# EAGLE design fonte (EAGLE 9.6.2)
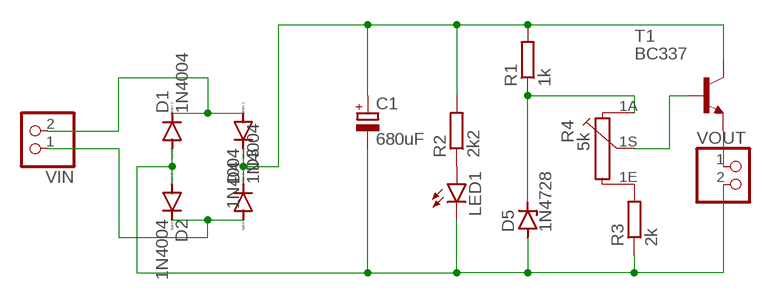
[diagram p0: schematic, sheet 1]

## Parts
C1  680uF  CPOL-EUE5-10.5  [E5-10,5]
D1  1N4004  [DO41-10]
D2  1N4004  [DO41-10]
D3  1N4004  [DO41-10]
D4  1N4004  [DO41-10]
D5  1N4728  [DO41Z10]
LED1  LED5MM  [LED5MM]
R1  1k  R-EU_0207/10  [0207/10]
R2  2k2  R-EU_0207/10  [0207/10]
R3  2k  R-EU_0207/10  [0207/10]
R4  5k  PC16S  [PC16S]
T1  BC337  [TO92]
VIN  PINHD-1X2  [1X02]
VOUT  PINHD-1X2  [1X02]

## Nets
N$1: C1.- D1.A D2.A D5.A LED1.K(C) R3.1 VOUT.2
N$2: C1.+ D3.C D4.C R1.2 R2.2 T1.3(C)
N$3: LED1.A R2.1
N$4: D5.C R1.1 R4.1A
N$5: D1.C D3.A VIN.2
N$6: D2.C D4.A VIN.1
N$7: T1.1(E) VOUT.1
N$8: R3.2 R4.1E
N$9: R4.1S T1.2(B)

## Library data of the parts
C1 = rcl:CPOL-EU: POLARIZED CAPACITOR, European symbol; SPICEPREFIX: C
D1-D4 = diode:1N4004: DIODE general purpose rectifier, 1 A
D5 = diode:1N4728: Z DIODE 3.3 V, 1W, 5 percent
LED1 = led:LED: LED OSRAM: - CHIPLED LG R971, LG N971, LY N971, LG Q971, LY Q971, LO R971, LY R971 LH N974, LH R974 LS Q976, LO Q976, LY Q976 LO Q996 - Hyper CHIPLED LW Q18S LB Q993, LB Q99A, LB R99A - SideLED LS A670, LO A670, LY A670, LG A670, LP A670 LB A673, LV A673, LT A673, LW A673 LH A674 LY A675 LS A676, LA A676, LO A676, LY A676, LW A676 LS A679, LY A679, LG A679 - Hyper Micro SIDELED® LS Y876, LA Y876, LO Y876, LY Y876 LT Y87S - SmartLED LW L88C, LW L88S LB L89C, LB L89S, LG L890 LS L89K, LO L89K, LY L89K LS L896, LA L896, LO L896, LY L896 - TOPLED LS T670, LO T670, LY T670, LG T670, LP T670 LSG T670, LSP T670, LSY T670, LOP T670, LYG T670 LG T671, LOG T671, LSG T671 LB T673, LV T673, LT T673, LW T673 LH T674 LS T676, LA T676, LO T676, LY T676, LB T676, LH T676, LSB T676, LW T676 LB T67C, LV T67C, LT T67C, LS T67K, LO T67K, LY T67K, LW E67C LS E67B, LA E67B, LO E67B, LY E67B, LB E67C, LV E67C, LT E67C LW T67C LS T679, LY T679, LG T679 LS T770, LO T770, LY T770, LG T770, LP T770 LB T773, LV T773, LT T773, LW T773 LH T774 LS E675, LA E675, LY E675, LS T675 LS T776, LA T776, LO T776, LY T776, LB T776 LHGB T686 LT T68C, LB T68C - Hyper Mini TOPLED® LB M676 - Mini TOPLED Santana® LG M470 LS M47K, LO M47K, LY M47K Source: http://www.osram.convergy.de LUXEON: - LUMILED® LXK2-PW12-R00, LXK2-PW12-S00, LXK2-PW14-U00, LXK2-PW14-V00 LXK2-PM12-R00, LXK2-PM12-S00, LXK2-PM14-U00 LXK2-PE12-Q00, LXK2-PE12-R00, LXK2-PE12-S00, LXK2-PE14-T00, LXK2-PE14-U00 LXK2-PB12-K00, LXK2-PB12-L00, LXK2-PB12-M00, LXK2-PB14-N00, LXK2-PB14-P00, LXK2-PB14-Q00 LXK2-PR12-L00, LXK2-PR12-M00, LXK2-PR14-Q00, LXK2-PR14-R00 LXK2-PD12-Q00, LXK2-PD12-R00, LXK2-PD12-S00 LXK2-PH12-R00, LXK2-PH12-S00 LXK2-PL12-P00, LXK2-PL12-Q00, LXK2-PL12-R00 Source: www.luxeon.com KINGBRIGHT: KA-3528ASYC Source: www.kingbright.com
R1-R3 = rcl:R-EU_: RESISTOR, European symbol; SPICEPREFIX: R
R4 = piher:PC16S: POTENTIOMETER single carbon potentiometer, 16 mm, S3ROH; OC_FARNELL: 4452940; OC_NEWARK: unknown
T1 = transistor:BC337: NPN TRANSISTOR
VIN VOUT = pinhead:PINHD-1X2: PIN HEADER

## Board
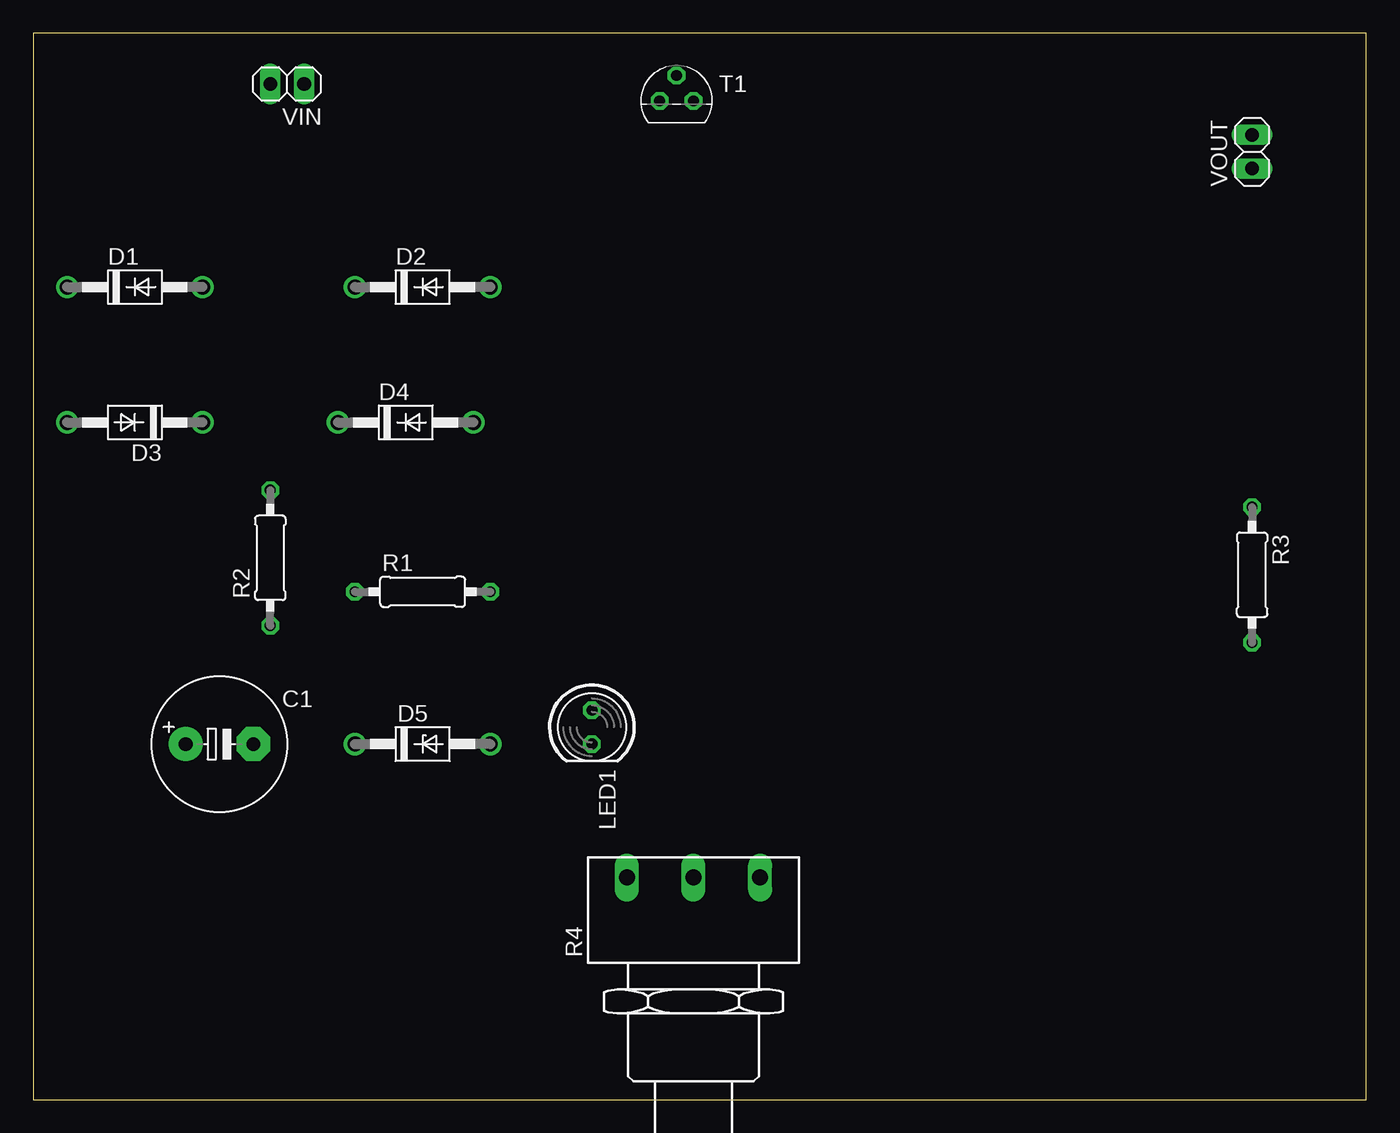
[diagram p1: board, top side]
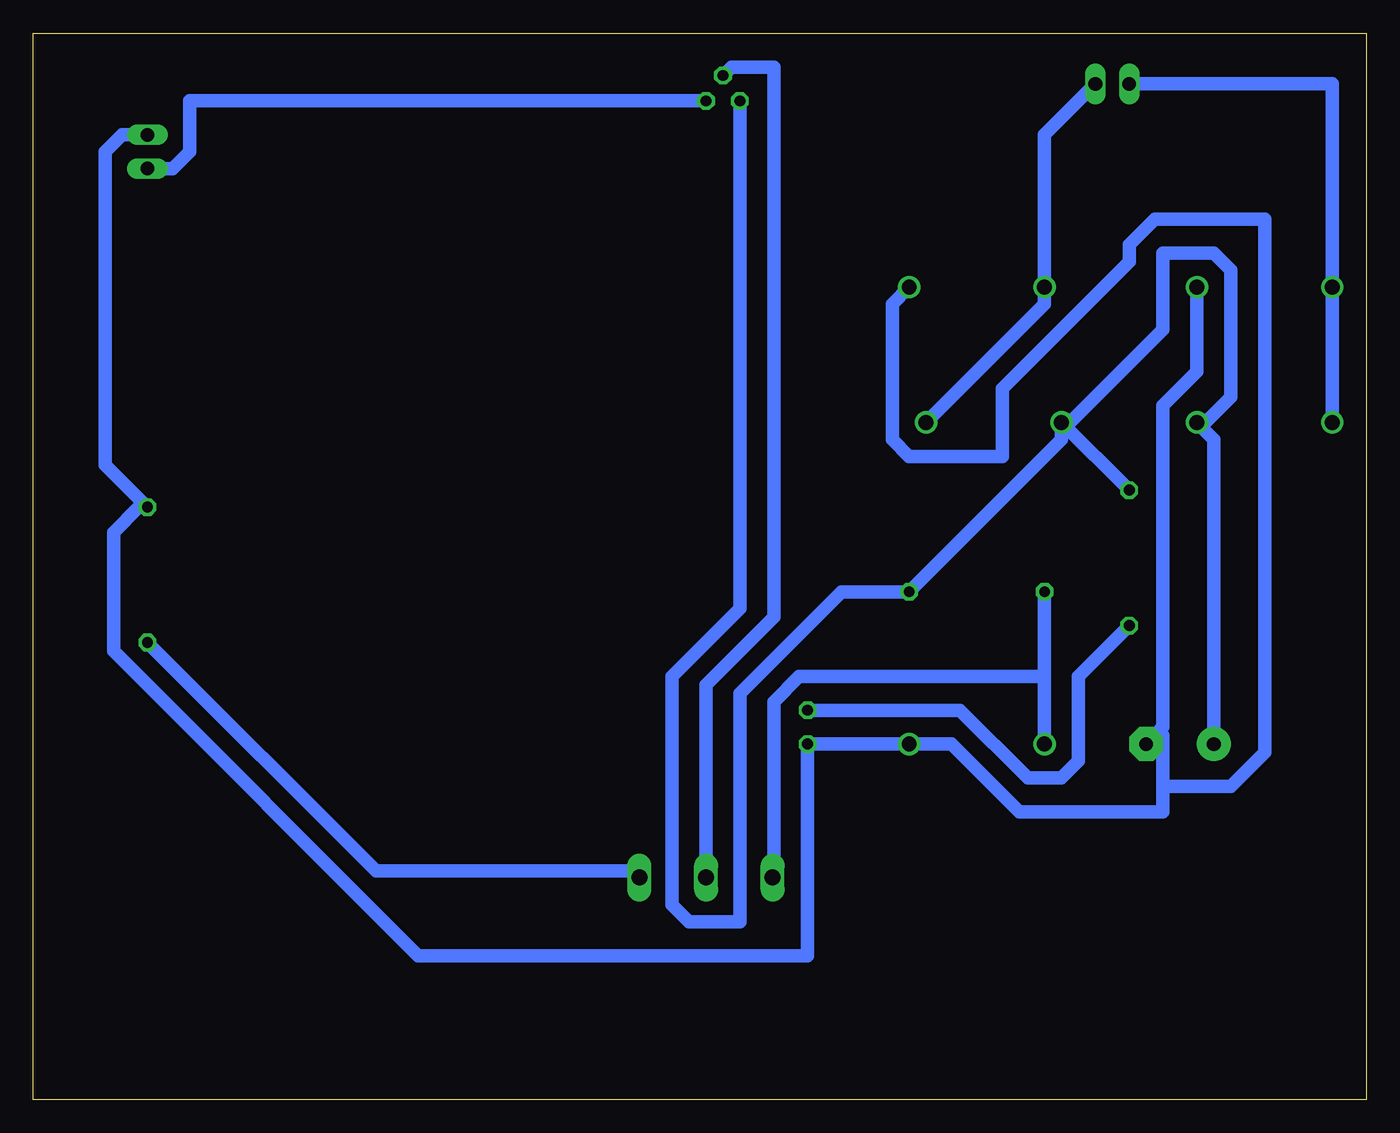
[diagram p2: board, bottom side, seen from below]

Size 100 x 80 mm. Coordinates in mm from the lower left corner, seen from the top.
Outline: 0,0 100,0 100,80 0,80 0,0
Copper layers (1*16): Top 0.035mm / dielectric 1.5mm / Bottom 0.035mm
Design rules "default *": minimum track width 40mil, minimum drill 0.35mm, track to track 40mil, track to pad 40mil, pad to pad 40mil, via to via 40mil, smd to smd 6mil, copper to edge 40mil, drill to drill 6mil, minimum pad ring 10mil, minimum via ring 8mil, stop-mask expansion 4mil, vias tented up to drill 0mil, thermal gap 10mil

### Footprints (pad centres in the part's own frame; a part is rotated, then mirrored left to right if it is on the bottom)
E5-10,5 = drill 1.016 pad 2.54: + -2.54,0 | drill 1.016 pad 2.54 octagon: - 2.54,0
DO41-10 = drill 1.118: A 5.08,0; C -5.08,0
DO41Z10 = drill 1.118: A 5.08,0; C -5.08,0
LED5MM = drill 0.813 octagon: A -1.27,0; K 1.27,0
0207/10 = drill 0.813 octagon: 1 -5.08,0; 2 5.08,0
PC16S = drill 1.2 long: 1A -5,6.5; 1E 5,6.5; 1S 0,6.5
TO92 = drill 0.813 octagon: 1 1.27,0; 2 0,1.905; 3 -1.27,0
1X02 = drill 1.016 long: 1 -1.27,0; 2 1.27,0

### Placement (x,y rotation side)
C1  13.97,26.67 0 top
D1  7.62,60.96 0 top
D2  29.21,60.96 0 top
D3  7.62,50.8 180 top
D4  27.94,50.8 0 top
D5  29.21,26.67 0 top
LED1  41.91,27.94 270 top
R1  29.21,38.1 0 top
R2  17.78,40.64 90 top
R3  91.44,39.37 270 top
R4  49.53,10.16 0 top
T1  48.26,74.93 0 top
VIN  19.05,76.2 180 top
VOUT  91.44,71.12 90 top

### Tracks (layer width: path | path; a pad name or v marks a point on that pad's centre or on a via)
N$1
  Bottom 1.016: VOUT.2 93.34,72.39 94.61,71.12 94.61,47.62 R3.1 92.08,44.45 93.98,42.55 93.98,33.66 71.12,10.79 41.91,10.79 LED1.K D5.A 31.11,26.67 26.04,21.59 15.24,21.59 15.24,23.5 | D1.A 12.7,54.61 15.24,52.07 15.24,27.94 15.56,27.62 | C1.- 15.56,27.62 | D2.A 35.56,59.69 35.56,49.53 34.29,48.26 27.3,48.26 27.3,53.34 17.78,62.87 17.78,64.14 15.88,66.04 7.62,66.04 7.62,26.04 10.16,23.5 15.24,23.5 | 15.24,23.5 15.24,27.3 15.56,27.62
N$2
  Bottom 1.016: C1.+ 11.43,49.53 D3.C 12.06,50.8 10.16,52.7 10.16,62.23 11.43,63.5 15.24,63.5 15.24,57.78 22.23,50.8 D4.C | D4.C R2.2 | D4.C 22.86,49.53 R1.2 39.37,38.1 46.99,30.48 46.99,13.34 50.8,13.34 52.07,14.61 52.07,31.75 46.99,36.83 T1.3
N$3
  Bottom 1.016: R2.1 21.59,31.75 21.59,25.4 22.86,24.13 25.4,24.13 30.48,29.21 LED1.A
N$4
  Bottom 1.016: D5.C 24.13,31.75 | 24.13,31.75 R1.1 | 24.13,31.75 42.55,31.75 44.45,29.84 44.45,17.14 R4.1A
N$5
  Bottom 1.016: VIN.2 2.54,76.2 D1.C D3.A
N$6
  Bottom 1.016: VIN.1 24.13,72.39 D2.C 24.13,59.69 D4.A
N$7
  Bottom 1.016: T1.1 88.27,74.93 88.27,71.12 89.53,69.85 VOUT.1
N$8
  Bottom 1.016: R3.2 74.3,17.14 54.61,17.14 R4.1E
N$9
  Bottom 1.016: T1.2 47.62,77.47 44.45,77.47 44.45,36.2 49.53,31.11 R4.1S